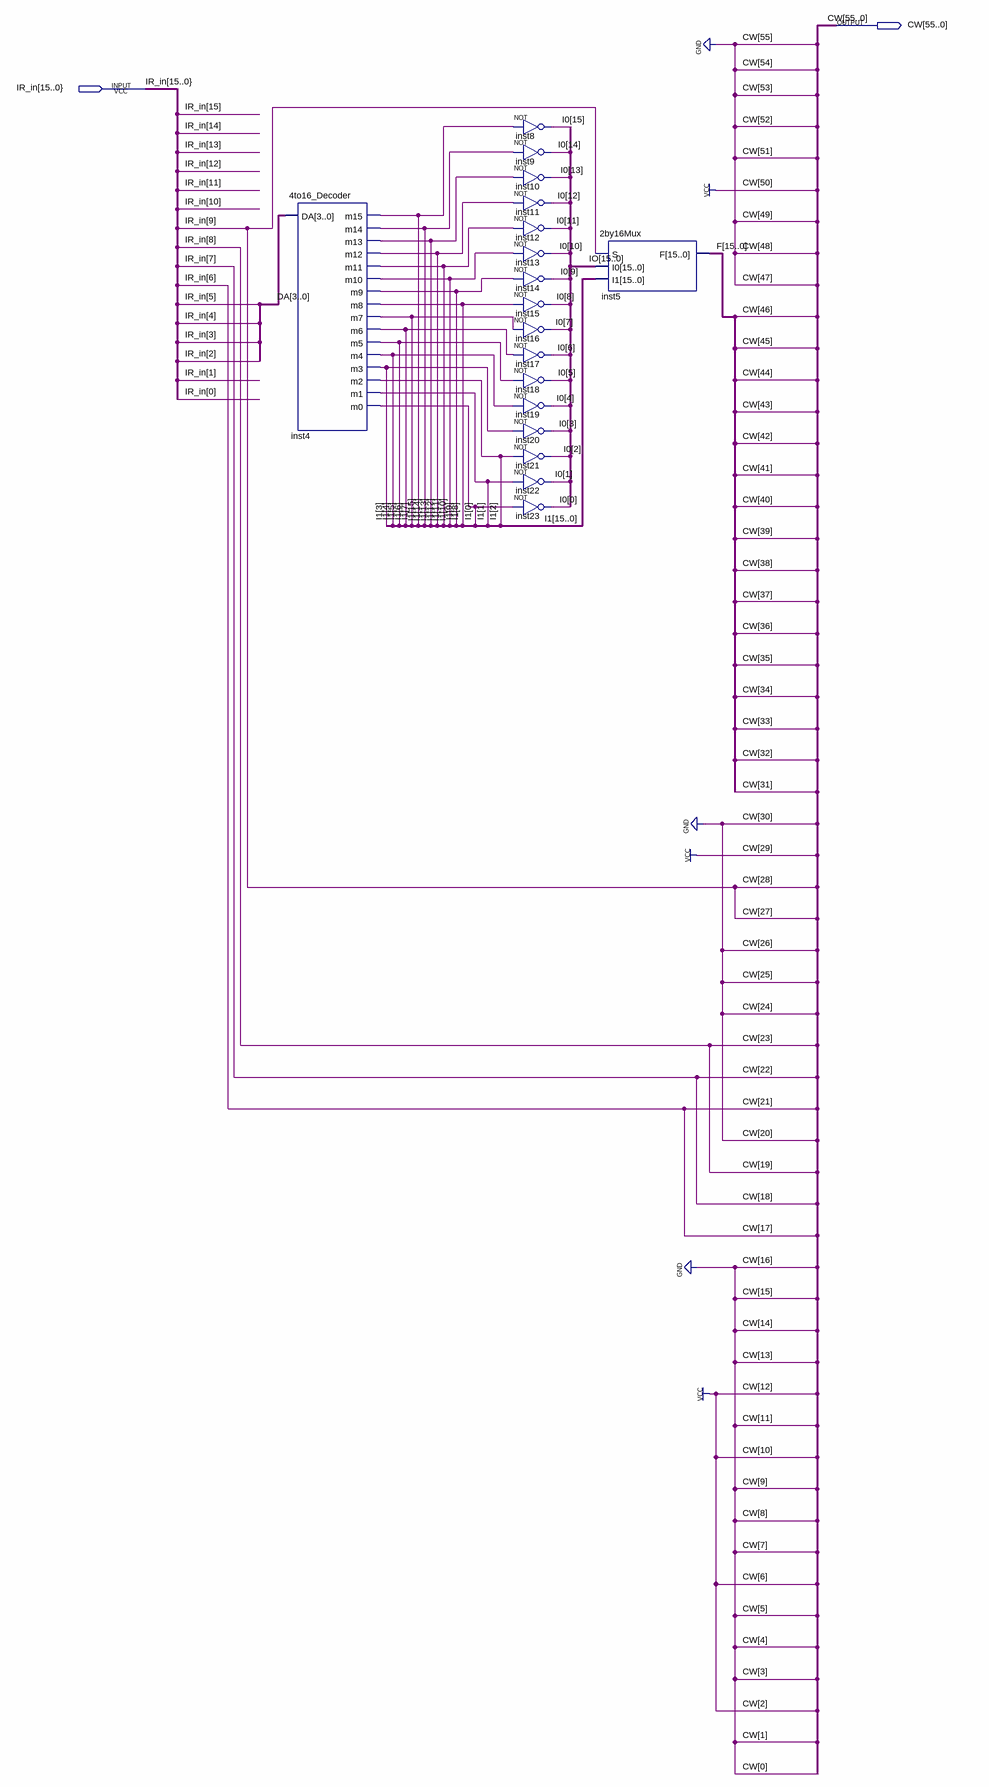
[diagram p0: schematic sheet]
// Quartus schematic Execute0_10_01.bdf as structural Verilog: 18 symbols, 2 pins
module Execute0_10_01 (
  input  \IR_in[15..0} ,
  output [55:0] CW
);

  wire [3:0] DA;
  wire [15:0] F, I0, I1, IO;

  \4to16_Decoder  inst4 (
    .DA(DA), .m15(I1[15]), .m14(I1[14]), .m13(I1[13]), .m12(I1[12]), .m11(I1[11]), .m10(I1[10]), .m9(I1[9]),
    .m8(I1[8]), .m7(I1[7]), .m6(I1[6]), .m5(I1[5]), .m4(I1[4]), .m3(I1[3]), .m2(I1[2]), .m1(I1[1]), .m0(I1[0]));
  not inst8 (I0[15], I1[15]);
  not inst9 (I0[14], I1[14]);
  not inst10 (I0[13], I1[13]);
  not inst11 (I0[12], I1[12]);
  not inst12 (I0[11], I1[11]);
  not inst13 (I0[10], I1[10]);
  not inst14 (I0[9], I1[9]);
  not inst15 (I0[8], I1[8]);
  not inst16 (I0[7], I1[7]);
  not inst17 (I0[6], I1[6]);
  not inst18 (I0[5], I1[5]);
  not inst19 (I0[4], I1[4]);
  not inst20 (I0[3], I1[3]);
  not inst21 (I0[2], I1[2]);
  not inst22 (I0[1], I1[1]);
  not inst23 (I0[0], I1[0]);
  \2by16Mux  inst5 (.S(CW[28]), .I0(IO), .I1(I1), .F(F));

  assign {CW[55:47], CW[30:29], CW[27:24], CW[20:0]} = {11'b00000100001, CW[28], 4'b0000, CW[23:21], 17'b00001010001000100};

  // Other names for the same wires on the sheet: IR_in[9:6] = {CW[28], CW[23:21]}
endmodule
